# Altium schematic sheet MCU (nrf5340).SchDoc
size A3; BoardTitle: nRF5340-QKAA Reference Layout - Config 1; DocumentNumber: 1; Revision: 1.2; SheetNumber: 3; SheetTotal: 9; DocumentSize: A3; RefLayoutTitle: Reference Layout Config. 1: VDDH supply, DCDC, USB; Device: nRF5340-QKAA; Classification: PUBLIC
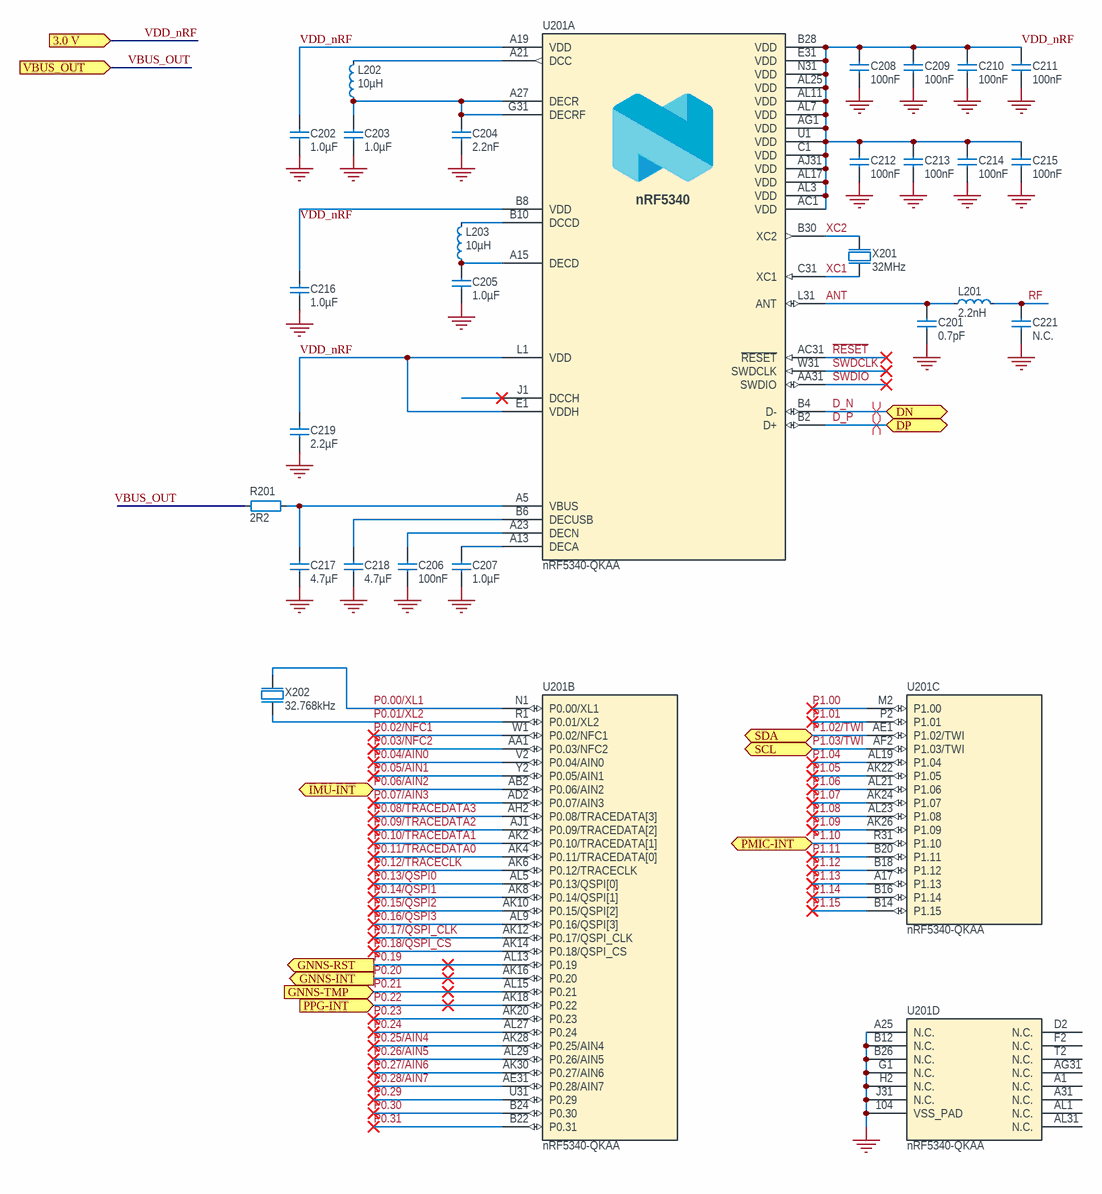
[diagram p0: MCU (nrf5340).SchDoc]

## Parts
C201  0.7pF  [CAPC0603X03L_C]
C202  1.0µF  [CAPC1005X04L]
C203  1.0µF  [CAPC1005X04L]
C204  2.2nF  [CAPC0603X03L_C]
C205  1.0µF  [CAPC1005X04L]
C206  100nF  [CAPC0603X03L_C]
C207  1.0µF  [CAPC1005X04L]
C208  100nF  [CAPC0603X03L_C]
C209  100nF  [CAPC0603X03L_C]
C210  100nF  [CAPC0603X03L_C]
C211  100nF  [CAPC0603X03L_C]
C212  100nF  [CAPC0603X03L_C]
C213  100nF  [CAPC0603X03L_C]
C214  100nF  [CAPC0603X03L_C]
C215  100nF  [CAPC0603X03L_C]
C216  1.0µF  [CAPC1005X04L]
C217  4.7µF  [CAPC1608X06L]
C218  4.7µF  [CAPC1608X06L]
C219  2.2µF  [CAPC1608X06L]
C221  N.C.  [CAPC0603X03L_C_NC]
L201  2.2nH  [INDC0603X03L_C]
L202  10µH  [INDC1608X06L]
L203  10µH  [INDC1608X06L]
R201  2R2  [RESC0603X03L_C]
U201  nRF5340-QKAA  [AQFN40P700X700X85_HS-99N]  (parts A,B,C,D of 4)
X201  32MHz  [BT-XTAL_2016]
X202  32.768kHz  [XTAL_2012]

## Ports
3.0 V (in, see Digital_Watch[2B], GNNS (SAM-M10Q-00B)[1A], Level Shifter (PCA9306JKZ)[2B], PMIC (nPM1300)[3B]), DN (bidir, see Digital_Watch[2B], USB-C[1B]), DP (bidir, see Digital_Watch[2B], USB-C[1B]), GNNS-INT (out, see Digital_Watch[3B], GNNS (SAM-M10Q-00B)[1A]), GNNS-RST (out, see Digital_Watch[3B], GNNS (SAM-M10Q-00B)[1A]), GNNS-TMP (in, see Digital_Watch[3B], GNNS (SAM-M10Q-00B)[1B]), IMU-INT (bidir, see Digital_Watch[3B], IMU (BMI270)[1B]), PMIC-INT (bidir, see Digital_Watch[3B], PMIC (nPM1300)[2B]), PPG-INT (in, see Digital_Watch[3B], PPG (MAX30102)[1A]), SCL (bidir, see Digital_Watch[3B], IMU (BMI270)[1A], Level Shifter (PCA9306JKZ)[2B], PMIC (nPM1300)[2C], PPG (MAX30102)[1A]), SDA (bidir, see Digital_Watch[3B], IMU (BMI270)[1B], Level Shifter (PCA9306JKZ)[2B], PMIC (nPM1300)[2C], PPG (MAX30102)[1A]), VBUS_OUT (in, see Digital_Watch[2B], PMIC (nPM1300)[4A])

## Nets
GND: C201.1 C202.2 C203.1 C204.2 C205.1 C206.2 C207.1 C208.2 C209.2 C210.2 C211.2 C212.2 C213.2 C214.2 C215.2 C216.1 C217.2 C218.2 C219.2 C221.1 U201.104(VSS_PAD) U201.A25(N.C.) U201.B12(N.C.) U201.B26(N.C.) U201.G1(N.C.) U201.H2(N.C.) U201.J31(N.C.) X201.2(GND) X201.4(GND)
ANT: C201.2 L201.2 U201.L31(ANT)
D_N: U201.B4(D-) ; port DN
D_P: U201.B2(D+) ; port DP
P0.00/XL1: U201.N1(P0.00/XL1) X202.1(inp)
P0.01/XL2: U201.R1(P0.01/XL2) X202.2(out)
P0.02/NFC1: U201.W1(P0.02/NFC1)
P0.03/NFC2: U201.AA1(P0.03/NFC2)
P0.04/AIN0: U201.V2(P0.04/AIN0)
P0.05/AIN1: U201.Y2(P0.05/AIN1)
P0.06/AIN2: U201.AB2(P0.06/AIN2) ; port IMU-INT
P0.07/AIN3: U201.AD2(P0.07/AIN3)
P0.08/TRACEDATA3: U201.AH2(P0.08/TRACEDATA[3])
P0.09/TRACEDATA2: U201.AJ1(P0.09/TRACEDATA[2])
P0.10/TRACEDATA1: U201.AK2(P0.10/TRACEDATA[1])
P0.11/TRACEDATA0: U201.AK4(P0.11/TRACEDATA[0])
P0.12/TRACECLK: U201.AK6(P0.12/TRACECLK)
P0.13/QSPI0: U201.AL5(P0.13/QSPI[0])
P0.14/QSPI1: U201.AK8(P0.14/QSPI[1])
P0.15/QSPI2: U201.AK10(P0.15/QSPI[2])
P0.16/QSPI3: U201.AL9(P0.16/QSPI[3])
P0.17/QSPI_CLK: U201.AK12(P0.17/QSPI_CLK)
P0.18/QSPI_CS: U201.AK14(P0.18/QSPI_CS)
P0.19: U201.AL13(P0.19) ; port GNNS-RST
P0.20: U201.AK16(P0.20) ; port GNNS-INT
P0.21: U201.AL15(P0.21) ; port GNNS-TMP
P0.22: U201.AK18(P0.22) ; port PPG-INT
P0.23: U201.AK20(P0.23)
P0.24: U201.AL27(P0.24)
P0.25/AIN4: U201.AK28(P0.25/AIN4)
P0.26/AIN5: U201.AL29(P0.26/AIN5)
P0.27/AIN6: U201.AK30(P0.27/AIN6)
P0.28/AIN7: U201.AE31(P0.28/AIN7)
P0.29: U201.U31(P0.29)
P0.30: U201.B24(P0.30)
P0.31: U201.B22(P0.31)
P1.00: U201.M2(P1.00)
P1.01: U201.P2(P1.01)
P1.02/TWI: U201.AE1(P1.02/TWI) ; port SDA
P1.03/TWI: U201.AF2(P1.03/TWI) ; port SCL
P1.04: U201.AL19(P1.04)
P1.05: U201.AK22(P1.05)
P1.06: U201.AL21(P1.06)
P1.07: U201.AK24(P1.07)
P1.08: U201.AL23(P1.08)
P1.09: U201.AK26(P1.09)
P1.10: U201.R31(P1.10) ; port PMIC-INT
P1.11: U201.B20(P1.11)
P1.12: U201.B18(P1.12)
P1.13: U201.A17(P1.13)
P1.14: U201.B16(P1.14)
P1.15: U201.B14(P1.15)
~{RESET}: U201.AC31(~{RESET})
RF: C221.2 L201.1
SWDCLK: U201.W31(SWDCLK)
SWDIO: U201.AA31(SWDIO)
VBUS_OUT: R201.1 ; port VBUS_OUT
VDD_nRF: C202.1 C208.1 C209.1 C210.1 C211.1 C212.1 C213.1 C214.1 C215.1 C216.2 C219.1 U201.A19(VDD) U201.AC1(VDD) U201.AG1(VDD) U201.AJ31(VDD) U201.AL3(VDD) U201.AL7(VDD) U201.AL11(VDD) U201.AL17(VDD) U201.AL25(VDD) U201.B8(VDD) U201.B28(VDD) U201.C1(VDD) U201.E1(VDDH) U201.E31(VDD) U201.L1(VDD) U201.N31(VDD) U201.U1(VDD) ; port 3.0 V
XC1: U201.C31(XC1) X201.1(inp)
XC2: U201.B30(XC2) X201.3(out)
NetC203_2: C203.2 C204.1 L202.1 U201.A27(DECR) U201.G31(DECRF)
NetC205_2: C205.2 L203.1 U201.A15(DECD)
NetC206_1: C206.1 U201.A23(DECN)
NetC207_2: C207.2 U201.A13(DECA)
NetC217_1: C217.1 R201.2 U201.A5(VBUS)
NetC218_1: C218.1 U201.B6(DECUSB)
NetL202_2: L202.2 U201.A21(DCC)
NetL203_2: L203.2 U201.B10(DCCD)

Not connected (* = marked no-connect by the designer): U201 A1(N.C.) A31(N.C.) AG31(N.C.) AL1(N.C.) AL31(N.C.) D2(N.C.) F2(N.C.) J1(DCCH)* T2(N.C.)

## Layout directives
differential pair: D_N, D_P

## Notes on the sheet
- Title
- Size
- Date:
- File:
- A3
- Device
- Sheet         of
- Drawn By:
- Revision
- Classification:
- (in symbol nRF5340-QKAA, part A) nRF5340

## Library data of the parts
C201 = C0201-0.7p: Capacitor, NP0, ±0.05pF; Pad Count: 2; Value: 0.7pF; Footprint Doc: 0201; Component Class: Capacitors
C202 C203 C205 C207 C216 = C0402-1µ0-10V-X7S-GRM155C71A105KE11: Capacitor, X7S, ±10%; Pad Count: 2; Value: 1.0µF; Footprint Doc: 0402; Component Class: Capacitors
  C202: Author: prbu
C204 = C0201-2n2: Capacitor, X7R, ±10%; Pad Count: 2; Value: 2.2nF; Footprint Doc: 0201; Component Class: Capacitors
C206 C208-C215 = C0201-100n-16V-X7S: Capacitor, X7S, ±10%; Pad Count: 2; Value: 100nF; Footprint Doc: 0201; Component Class: Capacitors
C217 = C0603-4µ7-10V-X7S: Capacitor, X7S, ±10%; Pad Count: 2; Value: 4.7µF; Footprint Doc: 0603; Component Class: Capacitors
C218 = C0603-4µ7-6.3V-X7R: Capacitor, X7R, ±10%; Pad Count: 2; Value: 4.7µF; Footprint Doc: 0603; Component Class: Capacitors
C219 = C0603-2µ2-6.3V-X7R: Capacitor, X7R, ±10%; Pad Count: 2; Value: 2.2µF; Footprint Doc: 0603; Component Class: Capacitors
C221 = C0201-N.C.: Not mounted; Assembly: Not mounted; Pad Count: 2; Value: N.C.; Footprint Doc: 0201; Component Class: Capacitors
L201 = L0201-2n2: High frequency chip inductor, ±5%; Pad Count: 2; Footprint Doc: 0201; Value: 2.2nH; Component Class: Inductors
L202 L203 = L0603-10µ: Chip Inductor, IDC,min = 50 mA, ±20%; Pad Count: 2; Value: 10µH; Footprint Doc: 0603; Component Class: Inductors
R201 = R0201: Resistor, ±1%, 0.05W; Pad Count: 2; Footprint Doc: 0201; Value: 2R2; Component Class: Resistors; Author: rsk
U201 = nRF5340-QKAA: Multi-protocol Bluetooth Low Energy, IEEE 802.15.4, ANT and 2.4GHz proprietary system-on-chip; Pad Count: 98; Footprint Doc: AQFN-98; Value: nRF5340-QKAA; Component Class: nRF_Devices
X201 = XTAL_SMD2016_32MHz_8pF_General: XTAL SMD 2016, 32MHz, Cl=8pF, Total Tol: ±30ppm; Pad Count: 4; Value: 32MHz; Footprint Doc: XTAL_2016; Component Class: Oscillators
X202 = XTAL_SMD2012_32.768kHz_9pF_General: XTAL SMD 2012, 32.768kHz, Cl=9pF, Total Tol: ±50ppm; Pad Count: 2; Value: 32.768kHz; Footprint Doc: XTAL_2012; Component Class: Oscillators